# Altium schematic sheet CAN_Activity_Module.SchDoc
size A4; SPICEModelCacheIPUPPCIY: <root> / <DocumentId>IPUPPCIY</DocumentId> / </root>
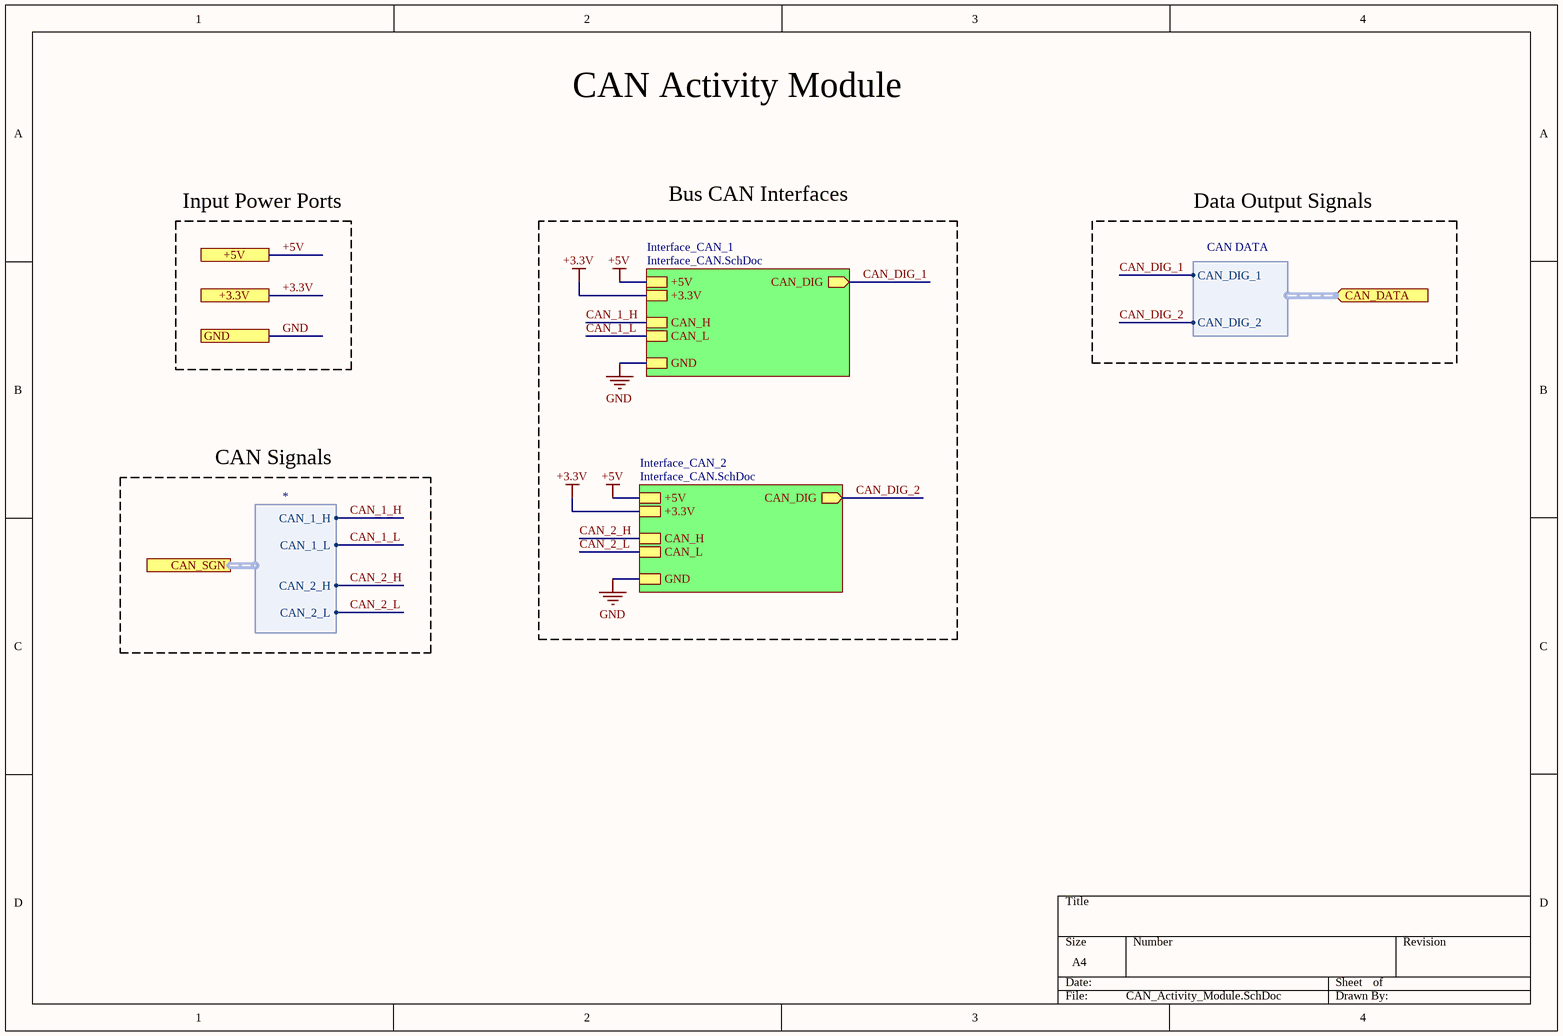
[diagram p0: CAN_Activity_Module.SchDoc]

## Sub-sheets
Interface_CAN_1 = Interface_CAN.SchDoc: GND, +5V, CAN_DIG (out), CAN_L, CAN_H, +3.3V
Interface_CAN_2 = Interface_CAN.SchDoc: GND, +5V, CAN_DIG (out), CAN_L, CAN_H, +3.3V

## Ports
+3.3V, +5V, CAN_DATA (in, harness CAN DATA), CAN_SGN (harness *), GND

## Harnesses
CAN DATA: CAN_DIG_1, CAN_DIG_2
*: CAN_1_H, CAN_1_L, CAN_2_H, CAN_2_L

## Nets
+3.3V: port +3.3V, sheet Interface_CAN_1/+3.3V, sheet Interface_CAN_2/+3.3V
+5V: port +5V, sheet Interface_CAN_1/+5V, sheet Interface_CAN_2/+5V
GND: port GND, sheet Interface_CAN_1/GND, sheet Interface_CAN_2/GND
CAN_1_H: sheet Interface_CAN_1/CAN_H, port CAN_SGN.CAN_1_H
CAN_1_L: sheet Interface_CAN_1/CAN_L, port CAN_SGN.CAN_1_L
CAN_2_H: sheet Interface_CAN_2/CAN_H, port CAN_SGN.CAN_2_H
CAN_2_L: sheet Interface_CAN_2/CAN_L, port CAN_SGN.CAN_2_L
CAN_DIG_1: sheet Interface_CAN_1/CAN_DIG, port CAN_DATA.CAN_DIG_1
CAN_DIG_2: sheet Interface_CAN_2/CAN_DIG, port CAN_DATA.CAN_DIG_2

## Notes on the sheet
- CAN Activity Module
- Input Power Ports
- Bus CAN Interfaces
- Data Output Signals
- CAN Signals